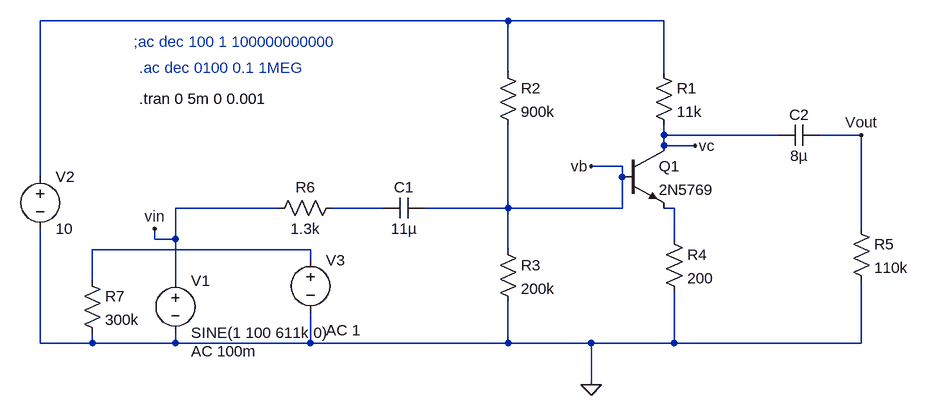
[diagram p0: schematic q3.asc]
q3.asc, the LTspice schematic file:
Version 4
SHEET 1 1248 680
WIRE 624 -208 -96 -208
WIRE 864 -208 624 -208
WIRE 624 -128 624 -208
WIRE 864 -128 864 -208
WIRE 864 -32 864 -48
WIRE 1040 -32 864 -32
WIRE 1168 -32 1104 -32
WIRE 864 -16 864 -32
WIRE 912 -16 864 -16
WIRE 800 16 752 16
WIRE -96 32 -96 -208
WIRE 800 32 800 16
WIRE 272 80 112 80
WIRE 432 80 352 80
WIRE 624 80 624 -48
WIRE 624 80 496 80
WIRE 800 80 800 32
WIRE 800 80 624 80
WIRE 880 80 864 80
WIRE 1168 112 1168 -32
WIRE 80 128 80 112
WIRE 112 128 112 80
WIRE 112 128 80 128
WIRE 880 128 880 80
WIRE 320 144 -16 144
WIRE 624 144 624 80
WIRE 320 160 320 144
WIRE -16 192 -16 144
WIRE 112 192 112 128
WIRE -96 288 -96 112
WIRE -16 288 -16 272
WIRE -16 288 -96 288
WIRE 112 288 112 272
WIRE 112 288 -16 288
WIRE 320 288 320 240
WIRE 320 288 112 288
WIRE 624 288 624 224
WIRE 624 288 320 288
WIRE 752 288 624 288
WIRE 880 288 880 208
WIRE 880 288 752 288
WIRE 1168 288 1168 192
WIRE 1168 288 880 288
WIRE 752 352 752 288
FLAG 752 352 0
FLAG 752 16 vb
FLAG 80 112 vin
FLAG 912 -16 vc
FLAG 1168 -32 Vout
SYMBOL voltage 112 176 R0
WINDOW 123 24 124 Left 2
WINDOW 39 0 0 Left 0
SYMATTR Value2 AC 100m
SYMATTR InstName V1
SYMATTR Value SINE(1 100 611k 0)
SYMBOL voltage -96 16 R0
WINDOW 123 0 0 Left 0
WINDOW 39 0 0 Left 0
SYMATTR InstName V2
SYMATTR Value 10
SYMBOL res 848 -144 R0
SYMATTR InstName R1
SYMATTR Value 11k
SYMBOL res 608 -144 R0
SYMATTR InstName R2
SYMATTR Value 900k
SYMBOL res 608 128 R0
SYMATTR InstName R3
SYMATTR Value 200k
SYMBOL res 864 112 R0
SYMATTR InstName R4
SYMATTR Value 200
SYMBOL res 1152 96 R0
SYMATTR InstName R5
SYMATTR Value 110k
SYMBOL res 368 64 R90
WINDOW 0 0 56 VBottom 2
WINDOW 3 32 56 VTop 2
SYMATTR InstName R6
SYMATTR Value 1.3k
SYMBOL res -32 176 R0
SYMATTR InstName R7
SYMATTR Value 300k
SYMBOL cap 496 64 R90
WINDOW 0 0 32 VBottom 2
WINDOW 3 32 32 VTop 2
SYMATTR InstName C1
SYMATTR Value 11µ
SYMBOL cap 1104 -48 R90
WINDOW 0 0 32 VBottom 2
WINDOW 3 32 32 VTop 2
SYMATTR InstName C2
SYMATTR Value 8µ
SYMBOL npn 800 -16 R0
SYMATTR InstName Q1
SYMATTR Value 2N5769
SYMBOL voltage 320 144 R0
WINDOW 123 24 124 Left 2
WINDOW 39 0 0 Left 0
SYMATTR Value2 AC 1
SYMATTR InstName V3
SYMATTR Value ""
TEXT 48 -176 Left 2 ;;ac dec 100 1 100000000000
TEXT 56 -136 Left 2 ;.ac dec 0100 0.1 1MEG
TEXT 56 -88 Left 2 !.tran 0 5m 0 0.001

The netlist it stands for:
* q3.asc
V1 vin 0 SINE(1 100 611k 0) AC 100m
V2 N001 0 10
R1 N001 vc 11k
R2 N001 vb 900k
R3 vb 0 200k
R4 N003 0 200
R5 Vout 0 110k
R6 N002 vin 1.3k
R7 N004 0 300k
C1 vb N002 11µ
C2 Vout vc 8µ
Q1 vc vb N003 0 2N5769
V3 N004 0 AC 1
.model NPN NPN
.model PNP PNP
.lib standard.bjt
* ;ac dec 100 1 100000000000
* .ac dec 0100 0.1 1MEG
.tran 0 5m 0 0.001
.backanno
.end